# Altium project NewBee.PrjPcb
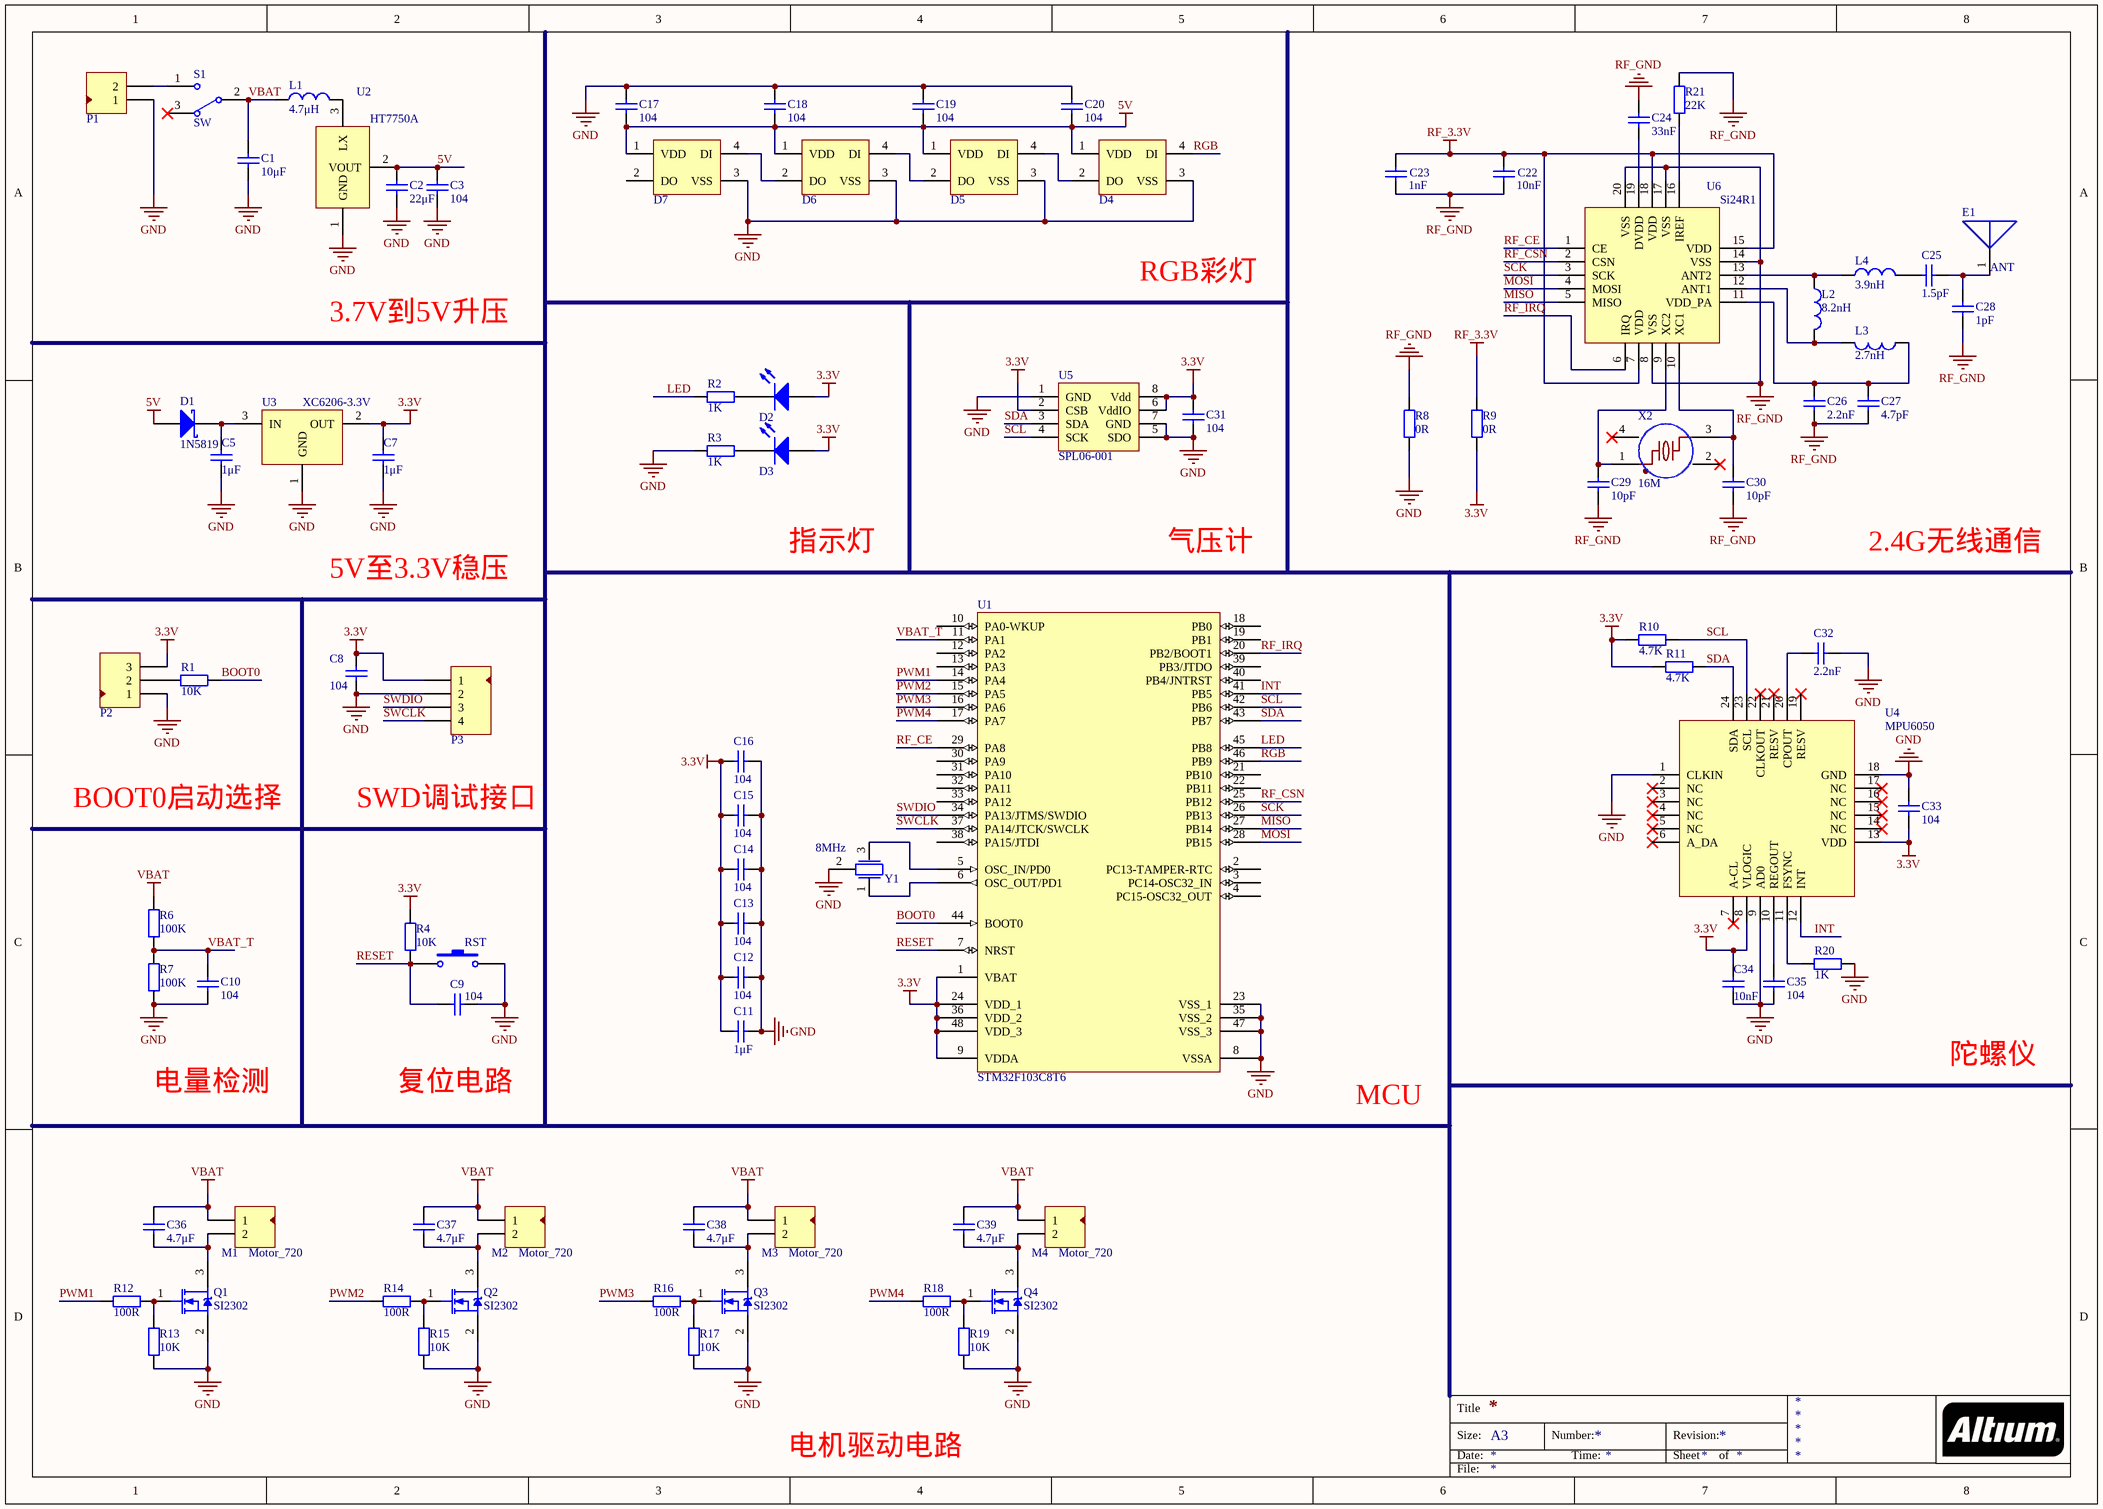
[diagram p0: NewBee.SchDoc]
1 sheet, 89 parts. Net scope: global (net labels, ports and power ports of the same name join across sheets).
Board file: NewBee.PcbDoc

## Sheet NewBee.SchDoc
size A3

### Parts
C1  10μF  [C-0603]
C2  22μF  [C-0603]
C3  104  [C-0603]
C5  1μF  [C-0603]
C7  1μF  [C-0603]
C8  104  [C-0603]
C9  104  [C-0603]
C10  104  [C-0603]
C11  1μF  [C-0603]
C12  104  [C-0603]
C13  104  [C-0603]
C14  104  [C-0603]
C15  104  [C-0603]
C16  104  [C-0603]
C17  104  [C-0603]
C18  104  [C-0603]
C19  104  [C-0603]
C20  104  [C-0603]
C22  10nF  [C-0603]
C23  1nF  [C-0603]
C24  33nF  [C-0603]
C25  1.5pF  [C-0603]
C26  2.2nF  [C-0603]
C27  4.7pF  [C-0603]
C28  1pF  [C-0603]
C29  10pF  [C-0603]
C30  10pF  [C-0603]
C31  104  [C-0603]
C32  2.2nF  [C-0603]
C33  104  [C-0603]
C34  10nF  [C-0603]
C35  104  [C-0603]
C36  4.7μF  [C-0603]
C37  4.7μF  [C-0603]
C38  4.7μF  [C-0603]
C39  4.7μF  [C-0603]
D1  1N5819  [SOD-323_L1.6-W1.3-LS2.7-RD]
D2  LED0  [LED-0805]  (value not drawn)
D3  LED0  [LED-0805]  (value not drawn)
D4  WS2812B  [SMD-5050-4]  (value not drawn)
D5  WS2812B  [SMD-5050-4]  (value not drawn)
D6  WS2812B  [SMD-5050-4]  (value not drawn)
D7  WS2812B  [SMD-5050-4]  (value not drawn)
E1  ANT  [AN3216]
L1  value 4.7μH  [1210]  (hidden comment: Inductor)
L2  value 8.2nH  [0603-1]  (hidden comment: Inductor)
L3  value 2.7nH  [0603-1]  (hidden comment: Inductor)
L4  value 3.9nH  [0603-1]  (hidden comment: Inductor)
M1  Motor_720  [PH2.0-2P-TH]
M2  Motor_720  [PH2.0-2P-TH]
M3  Motor_720  [PH2.0-2P-TH]
M4  Motor_720  [PH2.0-2P-TH]
P1  Header 2  [PH2.0-2P-SMD-WT]  (value not drawn)
P2  Header 3  [HDR3X1-2.54]  (value not drawn)
P3  Header 4  [HDR4X1-2.54]  (value not drawn)
Q1  SI2302  [SOT23-3]
Q2  SI2302  [SOT23-3]
Q3  SI2302  [SOT23-3]
Q4  SI2302  [SOT23-3]
R1  10K  [0603-1]
R2  1K  [0603-1]
R3  1K  [0603-1]
R4  10K  [0603-1]
R6  100K  [0603-1]
R7  100K  [0603-1]
R8  0R  [0603-1]
R9  0R  [0603-1]
R10  4.7K  [0603-1]
R11  4.7K  [0603-1]
R12  100R  [0603-1]
R13  10K  [0603-1]
R14  100R  [0603-1]
R15  10K  [0603-1]
R16  100R  [0603-1]
R17  10K  [0603-1]
R18  100R  [0603-1]
R19  10K  [0603-1]
R20  1K  [0603-1]
R21  22K  [0603-1]
RST  SW-PB  [SW_PB2_A1]  (value not drawn)
S1  SW  [SW-SMD_DEALON_MK-12D04-G2]
U1  STM32F103C8T6  [LQFP-48]
U2  HT7750A  [SOT-89-3_L4.5-W2.5-P1.50-LS4.2-BR]
U3  XC6206-3.3V  [SOT23-3]
U4  MPU6050  [QFN-24_4x4x05P]
U5  SPL06-001  [SENSOR-SMD_SPL06-001]
U6  Si24R1  [QFN20]
X2  16M  [X-SMD_4P-L3.2-W2.5-BL]
Y1  8MHz  [OSC-SMD_3P-L3.2-W1.3-P1.20-L]

### Nets
3.3V: C7.1 C8.1 C11.2 C12.2 C13.2 C14.1 C15.2 C16.2 C31.2 C33.2 C34.2 D2.1(A) D3.1(A) P2.3 P3.1 R4.2 R9.2 R10.1 R11.1 U1.1(VBAT) U1.9(VDDA) U1.24(VDD_1) U1.36(VDD_2) U1.48(VDD_3) U3.2(OUT) U4.8(VLOGIC) U4.13(VDD) U5.2(CSB) U5.6(VddIO) U5.8(Vdd)
5V: C2.2 C3.2 C17.1 C18.1 C19.1 C20.1 D1.1(A) D4.1(VDD) D5.1(VDD) D6.1(VDD) D7.1(VDD) U2.2(VOUT)
GND: C1.1 C2.1 C3.1 C5.2 C7.2 C8.2 C9.2 C10.1 C11.1 C12.1 C13.1 C14.2 C15.1 C16.1 C17.2 C18.2 C19.2 C20.2 C31.1 C32.1 C33.1 C34.1 C35.2 D4.3(VSS) D5.3(VSS) D6.3(VSS) D7.3(VSS) P1.1 P2.1 P3.2 Q1.2(S) Q2.2(S) Q3.2(S) Q4.2(S) R3.1 R7.2 R8.2 R13.1 R15.1 R17.1 R19.1 R20.1 RST.2 U1.8(VSSA) U1.23(VSS_1) U1.35(VSS_2) U1.47(VSS_3) U2.1(GND) U3.1(GND) U4.1(CLKIN) U4.9(AD0) U4.18(GND) U5.1(GND) U5.5(SDO) U5.7(GND) Y1.2
RF_3.3V: C22.2 C23.2 R9.1 U6.7(VDD) U6.15(VDD) U6.18(VDD)
RF_GND: C22.1 C23.1 C24.2 C26.2 C27.2 C28.1 C29.1 C30.1 R8.1 R21.2 U6.8(VSS) U6.14(VSS) U6.17(VSS) U6.20(VSS)
VBAT: C1.2 C36.1 C37.1 C38.1 C39.1 L1.1 M1.1 M2.1 M3.1 M4.1 R6.1 S1.2
BOOT0: R1.1 U1.44(BOOT0)
INT: U1.41(PB5) U4.12(INT)
LED: R2.1 U1.45(PB8)
MISO: U1.27(PB14) U6.5(MISO)
MOSI: U1.28(PB15) U6.4(MOSI)
PWM1: R12.1 U1.14(PA4)
PWM2: R14.1 U1.15(PA5)
PWM3: R16.1 U1.16(PA6)
PWM4: R18.1 U1.17(PA7)
RESET: C9.1 R4.1 RST.1 U1.7(NRST)
RF_CE: U1.29(PA8) U6.1(CE)
RF_CSN: U1.25(PB12) U6.2(CSN)
RF_IRQ: U1.20(PB2/BOOT1) U6.6(IRQ)
RGB: D4.4(DI) U1.46(PB9)
SCK: U1.26(PB13) U6.3(SCK)
SCL: R10.2 U1.42(PB6) U4.23(SCL) U5.4(SCK)
SDA: R11.2 U1.43(PB7) U4.24(SDA) U5.3(SDA)
SWCLK: P3.4 U1.37(PA14/JTCK/SWCLK)
SWDIO: P3.3 U1.34(PA13/JTMS/SWDIO)
VBAT_T: C10.2 R6.2 R7.1 U1.11(PA1)
NetC5_1: C5.1 D1.2(K) U3.3(IN)
NetC24_1: C24.1 U6.19(DVDD)
NetC25_1: C25.1 C28.2 E1.1
NetC25_2: C25.2 L4.2
NetC26_1: C26.1 C27.1 L3.1 U6.11(VDD_PA)
NetC29_2: C29.2 U6.9(XC2) X2.1
NetC30_2: C30.2 U6.10(XC1) X2.3
NetC32_2: C32.2 U4.20(CPOUT)
NetC35_1: C35.1 U4.10(REGOUT)
NetC36_2: C36.2 M1.2 Q1.3(D)
NetC37_2: C37.2 M2.2 Q2.3(D)
NetC38_2: C38.2 M3.2 Q3.3(D)
NetC39_2: C39.2 M4.2 Q4.3(D)
NetD2_2: D2.2(K) R2.2
NetD3_2: D3.2(K) R3.2
NetD4_2: D4.2(DO) D5.4(DI)
NetD5_2: D5.2(DO) D6.4(DI)
NetD6_2: D6.2(DO) D7.4(DI)
NetL1_2: L1.2 U2.3(LX)
NetL2_1: L2.1 L4.1 U6.13(ANT2)
NetL2_2: L2.2 L3.2 U6.12(ANT1)
NetP1_2: P1.2 S1.1
NetP2_2: P2.2 R1.2
NetQ1_1: Q1.1(G) R12.2 R13.2
NetQ2_1: Q2.1(G) R14.2 R15.2
NetQ3_1: Q3.1(G) R16.2 R17.2
NetQ4_1: Q4.1(G) R18.2 R19.2
NetR20_2: R20.2 U4.11(FSYNC)
NetR21_1: R21.1 U6.16(IREF)
NetU1_5: U1.5(OSC_IN/PD0) Y1.3
NetU1_6: U1.6(OSC_OUT/PD1) Y1.1

Not connected (* = marked no-connect by the designer): D7 2(DO); S1 3*; U1 2(PC13-TAMPER-RTC) 3(PC14-OSC32_IN) 4(PC15-OSC32_OUT) 10(PA0-WKUP) 12(PA2) 13(PA3) 18(PB0) 19(PB1) 21(PB10) 22(PB11) 30(PA9) 31(PA10) 32(PA11) 33(PA12) 38(PA15/JTDI) 39(PB3/JTDO) 40(PB4/JNTRST); U4 2(NC)* 3(NC)* 4(NC)* 5(NC)* 6(A_DA)* 7(A-CL)* 14(NC)* 15(NC)* 16(NC)* 17(NC)* 19(RESV)* 21(RESV)* 22(CLKOUT)*; X2 2(GND)* 4(GND)*

### Notes on the sheet
- RGB彩灯
- 3.7V到5V升压
- 5V至3.3V稳压
- 指示灯
- 气压计
- 2.4G无线通信
- BOOT0启动选择
- SWD调试接口
- 电量检测
- 复位电路
- MCU
- 陀螺仪
- 电机驱动电路
- Title
- Size:
- Date:
- A3
- Number:
- Time:
- Revision:
- Sheet
- of
- File:

### Library data of the parts
C1-C3 C5 C7-C20 C22-C39 = Cap-S: 贴片瓷片电容; Published: 8-Jun-2000; LatestRevisionDate: 17-Jul-2002; LatestRevisionNote: Re-released for DXP Platform.; PackageReference: RAD-0.3; Publisher: Altium Limited
  C1: Value: 10μF
  C2: Value: 22μF
  C3 C8-C10 C12-C20 C31 C33 C35: Value: 104
  C5 C7 C11: Value: 1μF
  C22 C34: Value: 10nF
  C23: Value: 1nF
  C24: Value: 33nF
  C25: Value: 1.5pF
  C26 C32: Value: 2.2nF
  C27: Value: 4.7pF
  C28: Value: 1pF
  C29 C30: Value: 10pF
  C36-C39: Value: 4.7μF
D1 = Diode-Schottky: 肖特基二极管; Published: 8-Jun-2000; LatestRevisionDate: 17-Jul-2002; LatestRevisionNote: Re-released for DXP Platform.; PackageReference: SMB; Publisher: Altium Limited; Code_JEDEC: DO-214-AA; Type: 1N5819
D2 D3 = LED0: 发光二极管; Published: 8-Jun-2000; LatestRevisionDate: 08-Jul-2005; LatestRevisionNote: Mech Layer 1 removed.; PackageReference: LED-0; Publisher: Altium Limited
D4-D7 = WS2812B: WS2812B 4脚RGB全彩LED
E1 = ANT: 2.4G Antenna; Published: 12-August-2017; Publisher: mazhongwei
L1-L4 = Inductor: 电感; Code_IEC: 1005; Published: 8-Jun-2000; LatestRevisionDate: 17-Jul-2002; LatestRevisionNote: Re-released for DXP Platform.; PackageReference: 0402-A; Publisher: Altium Limited; Code_JEITA: 0402
M1-M4 P1 = Header 2: 接插件; LatestRevisionDate: 17-Jul-2002; LatestRevisionNote: Re-released for DXP Platform.; Publisher: Altium Limited
P2 = Header 3: 接插件; LatestRevisionDate: 17-Jul-2002; LatestRevisionNote: Re-released for DXP Platform.; Publisher: Altium Limited
P3 = Header 4: 接插件; LatestRevisionDate: 17-Jul-2002; LatestRevisionNote: Re-released for DXP Platform.; Publisher: Altium Limited
Q1-Q4 = SI2302: N沟道贴片; PackageDocument: 1995/1996; Published: 8-Jun-2000; LatestRevisionDate: 17-Jul-2002; LatestRevisionNote: Re-released for DXP Platform.; PackageReference: E3; Publisher: Altium Limited
R1-R4 R6-R21 = Res1: 贴片电阻; Published: 8-Jun-2000; LatestRevisionDate: 17-Jul-2002; LatestRevisionNote: Re-released for DXP Platform.; PackageReference: AXIAL-0.4; Publisher: Altium Limited
  R1 R4 R13 R15 R17 R19: Value: 10K
  R2 R3 R20: Value: 1K
  R6 R7: Value: 100K
  R8 R9: Value: 0R
  R10 R11: Value: 4.7K
  R12 R14 R16 R18: Value: 100R
  R21: Value: 22K
RST = SW-PB: 微动开关; Published: 24-Mar-1999; LatestRevisionDate: 17-Jul-2002; LatestRevisionNote: Re-released for DXP Platform.; PackageReference: SPST-2; Publisher: Altium Limited
S1 = SW-SPDT: 开关; Published: 24-Mar-1999; LatestRevisionDate: 17-Dec-2003; LatestRevisionNote: Schematic revised, PCB Footprint replaced.; PackageReference: TL36WW15050; Publisher: Altium Limited; DatasheetDocument: 05-Dec-2000; ComponentLink1Description: Manufacturer Link; ComponentLink1URL: http://www.apem.com
U1 = STM32F103C8T6: STM32F103, 48引脚, 64Kb Flash, 20Kb SRAM; Published: 30-May-2008; DatasheetVersion: rev6, Mar-2008; PackageVersion: Mar-2008; PackageReference: LQFP48; Publisher: Altium Limited; PackageDescription: 48-Pin Low-Profile Quad Flat Pack, 7 x 7 mm Body, 0.5 mm Pitch (LQFP48); ComponentLink1Description: Manufacturer Link; ComponentLink1URL: www.st.com/stm32; ComponentLink2Description: Datasheet; ComponentLink2URL: http://www.st.com/stonline/products/literature/ds/13587.pdf
U2 = HT7750SA_SOT89
U3 = XC6206: 稳压芯片
U5 = FBM320: 气压计; Published: 8-August-2017; Publisher: mazhongwei; PackageReference: LGA-2_5X2MM
U6 = nRF24L01
X2 = XTAL-4PIN: Value: 16M
Y1 = XTAL-3PIN: 贴片晶振; Value: 8MHz